# EAGLE design GB202-CC-Modem (EAGLE 7.2.0)
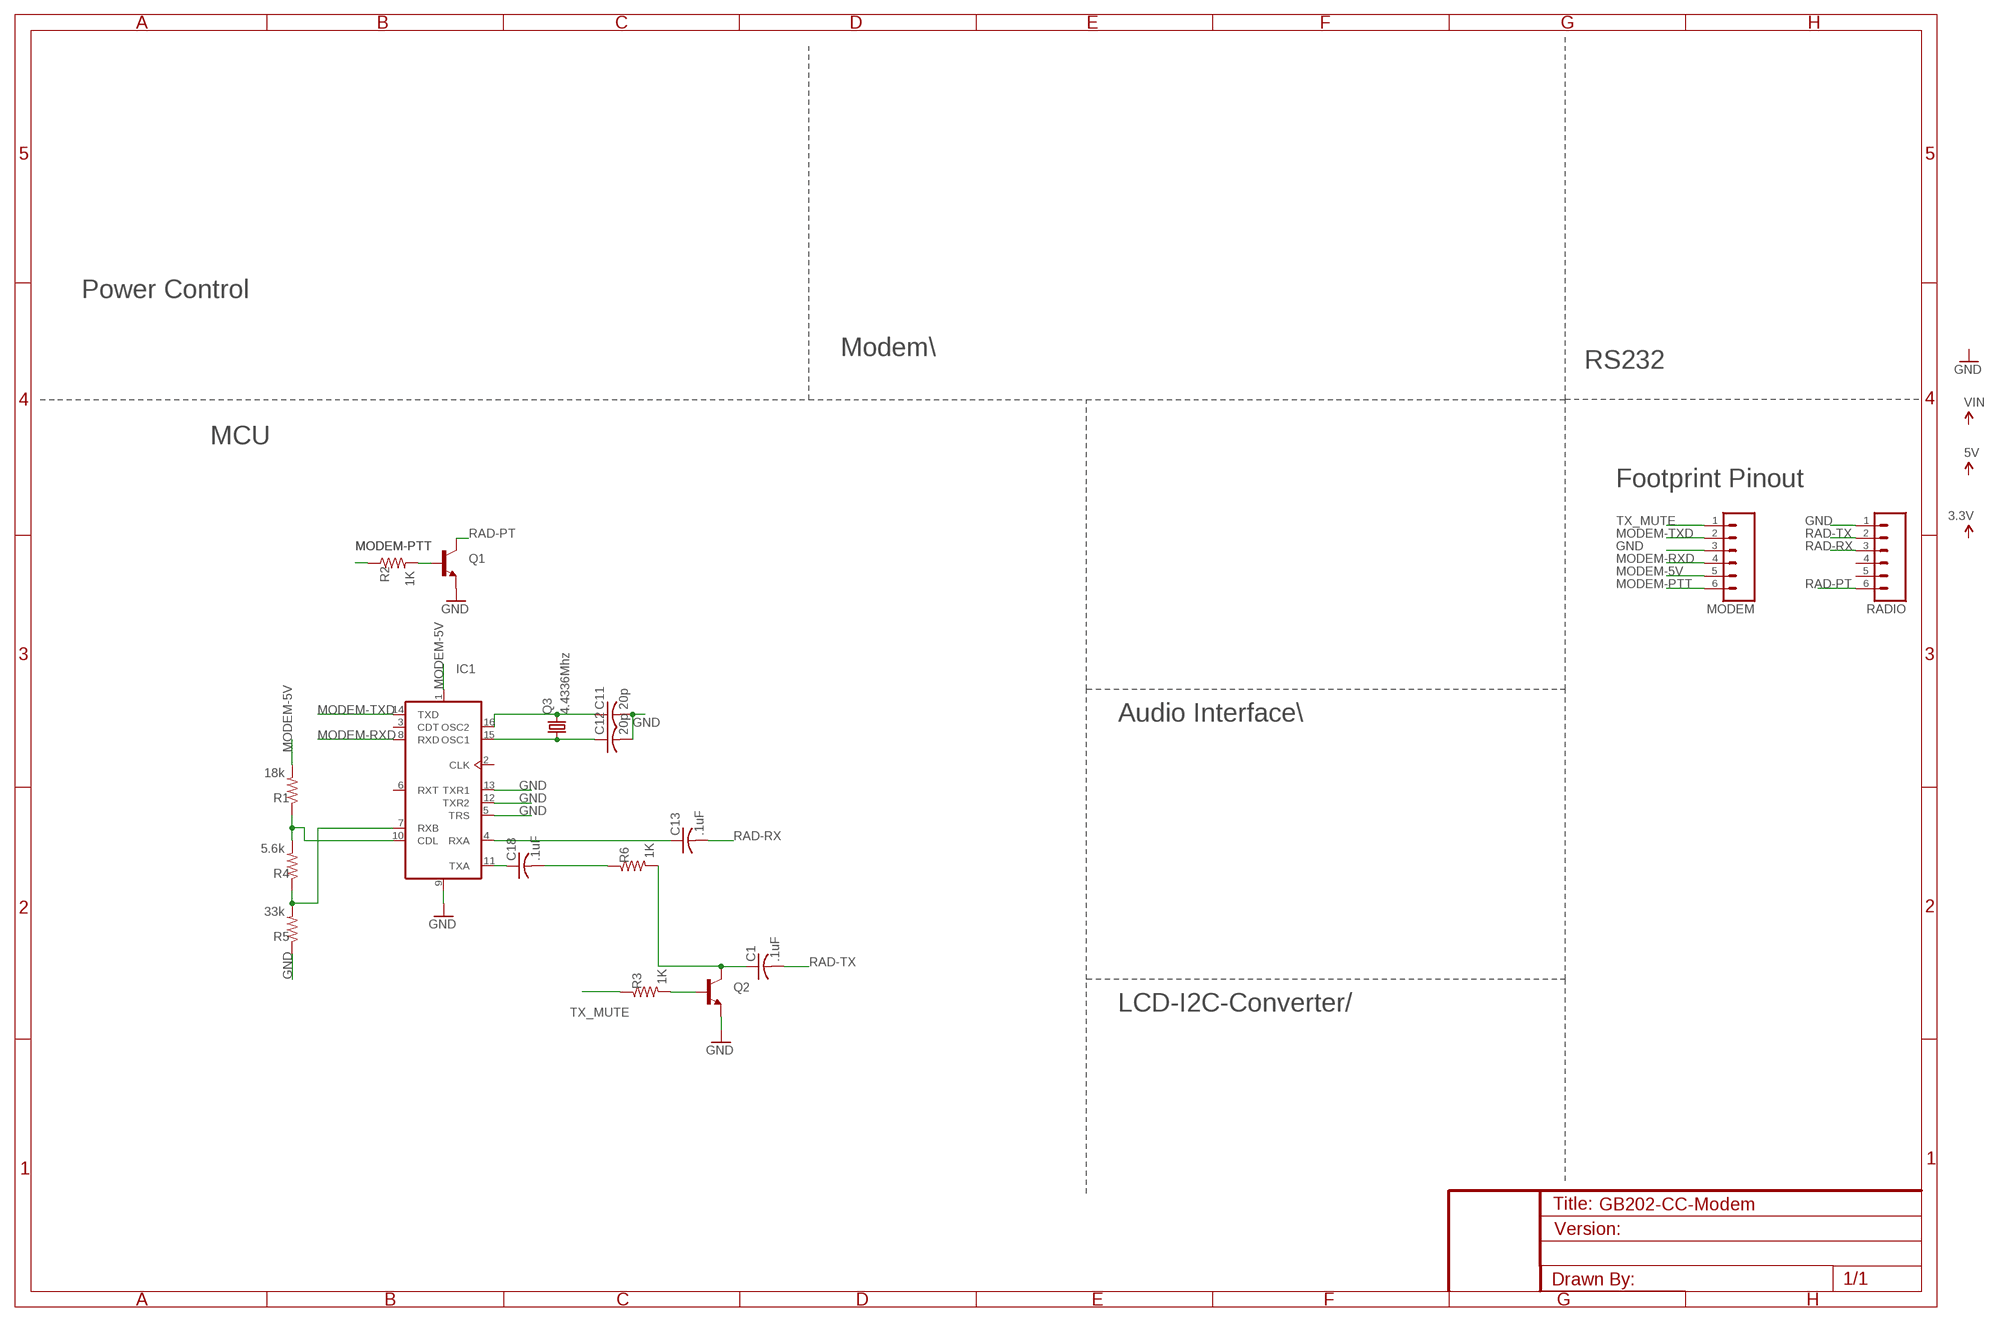
[diagram p0: schematic, sheet 1]

## Parts
C1  .1uF  C-US050-024X044  [C050-024X044]
C11  20p  C-USC0603  [C0603]
C12  20p  C-USC0603  [C0603]
C13  .1uF  C-US050-024X044  [C050-024X044]
C18  .1uF  C-US050-024X044  [C050-024X044]
IC1  TCM3105  [DIL16]
MODEM  M06LONGPADS  [1X06_LONGPADS]
Q1  TRANSISTOR_NPNP2N2222A  [TO-92]
Q2  TRANSISTOR_NPN2N3904  [TO-92]
Q3  4.4336Mhz  CRYSTALHC49S  [HC49/S]
R1  18k  RESISTORAXIAL-0.3  [AXIAL-0.3]
R2  1K  RESISTORAXIAL-0.3  [AXIAL-0.3]
R3  1K  RESISTORAXIAL-0.3  [AXIAL-0.3]
R4  5.6k  RESISTORAXIAL-0.3  [AXIAL-0.3]
R5  33k  RESISTORKIT  [AXIAL-0.3-KIT]
R6  1K  RESISTORAXIAL-0.3  [AXIAL-0.3]
RADIO  M06LONGPADS  [1X06_LONGPADS]

## Nets
GND: C11.2 C12.2 IC1.5(TRS) IC1.9(VSS) IC1.12(TXR2) IC1.13(TXR1) MODEM.3 Q1.3(E) Q2.1(E) R5.P$1 RADIO.1
MODEM-5V: IC1.1(VDD) MODEM.5 R1.P$2
MODEM-PTT: MODEM.6 R2.P$1
MODEM-RXD: IC1.8(RXD) MODEM.4
MODEM-TXD: IC1.14(TXD) MODEM.2
N$1: Q1.2(B) R2.P$2
N$2: C1.1 Q2.3(C) R6.P$2
N$6: Q2.2(B) R3.P$2
N$10: C11.1 IC1.16(OSC2) Q3.2
N$11: C12.1 IC1.15(OSC1) Q3.1
N$12: C13.1 IC1.4(RXA)
N$17: IC1.10(CDL) R1.P$1 R4.P$2
N$18: IC1.7(RXB) R4.P$1 R5.P$2
N$19: C18.1 IC1.11(TXA)
N$20: C18.2 R6.P$1
RAD-PT: Q1.1(C) RADIO.6
RAD-RX: C13.2 RADIO.3
RAD-TX: C1.2 RADIO.2
TX_MUTE: MODEM.1 R3.P$1
Unconnected: IC1.2(CLK) IC1.3(CDT) IC1.6(RXT) RADIO.4 RADIO.5

## Notes on the sheet
- Power Control
- Modem\
- RS232
- MCU
- Footprint Pinout
- Audio Interface\
- LCD-I2C-Converter/

## Library data of the parts
C1 C11-C13 C18 = rcl:C-US: CAPACITOR, American symbol
IC1 = tcm3105:TCM3105
MODEM RADIO = SparkFun-Connectors:M06: Header 6 Standard 6-pin 0.1" header. Use with straight break away headers (SKU : PRT-00116), right angle break away headers (PRT-00553), swiss pins (PRT-00743), machine pins (PRT-00117), and female headers (PRT-00115). Molex polarized connector foot print use with SKU : PRT-08094 with associated crimp pins and housings. NOTES ON THE VARIANTS LOCK and LOCK_LONGPADS... This footprint was designed to help hold the alignment of a through-hole component (i.e. 6-pin header) while soldering it into place. You may notice that each hole has been shifted either up or down by 0.005 of an inch from it's more standard position (which is a perfectly straight line). This slight alteration caused the pins (the squares in the middle) to touch the edges of the holes. Because they are alternating, it causes a "brace" to hold the component in place. 0.005 has proven to be the perfect amount of "off-center" position when using our standard breakaway headers. Although looks a little odd when you look at the bare footprint, once you have a header in there, the alteration is very hard to notice. Also,if you push a header all the way into place, it is covered up entirely on the bottom side. This idea of altering the position of holes to aid alignment will be further integrated into the Sparkfun Library for other footprints. It can help hold any component with 3 or more connection pins.
Q1 = SparkFun-DiscreteSemi:TRANSISTOR_NPN: Generic NPN BJT MMBT2222A - TRANS-08049 (SOT-23, 1A 40V) MPSA42 - TRANS-09116 (SOT-23, 500mA 300V) MMBT5088LT1G - TRANS-11160 (SOT-23, 50 mA 30V) BC547 - COM-08928 <http://www.sparkfun.com/products/8928> (TO-92 45V 100mA) (1.Collector 2.Base 3.Emitter) 2N3904 - COM-00521 <http://www.sparkfun.com/products/521> (TO-92 40V 200mA) (1.Emitter 2.Base 3.Collector) P2N2222A - COM-12852 <http://www.sparkfun.com/products/12852> (TO-92 40V 600mA) (1.Collector 2.Base 3.Emitter); PROD_ID: TRANS-09536
Q2 = SparkFun-DiscreteSemi:TRANSISTOR_NPN: Generic NPN BJT MMBT2222A - TRANS-08049 (SOT-23, 1A 40V) MPSA42 - TRANS-09116 (SOT-23, 500mA 300V) MMBT5088LT1G - TRANS-11160 (SOT-23, 50 mA 30V) BC547 - COM-08928 <http://www.sparkfun.com/products/8928> (TO-92 45V 100mA) (1.Collector 2.Base 3.Emitter) 2N3904 - COM-00521 <http://www.sparkfun.com/products/521> (TO-92 40V 200mA) (1.Emitter 2.Base 3.Collector) P2N2222A - COM-12852 <http://www.sparkfun.com/products/12852> (TO-92 40V 600mA) (1.Collector 2.Base 3.Emitter); PROD_ID: TRANS-08447
Q3 = crystal:CRYSTAL: CRYSTAL; OC_FARNELL: 1667008; OC_NEWARK: unknown
R1-R6 = SparkFun-Resistors:RESISTOR: Resistor Basic schematic elements and footprints for 0603, 1206, and PTH resistors.

## Board
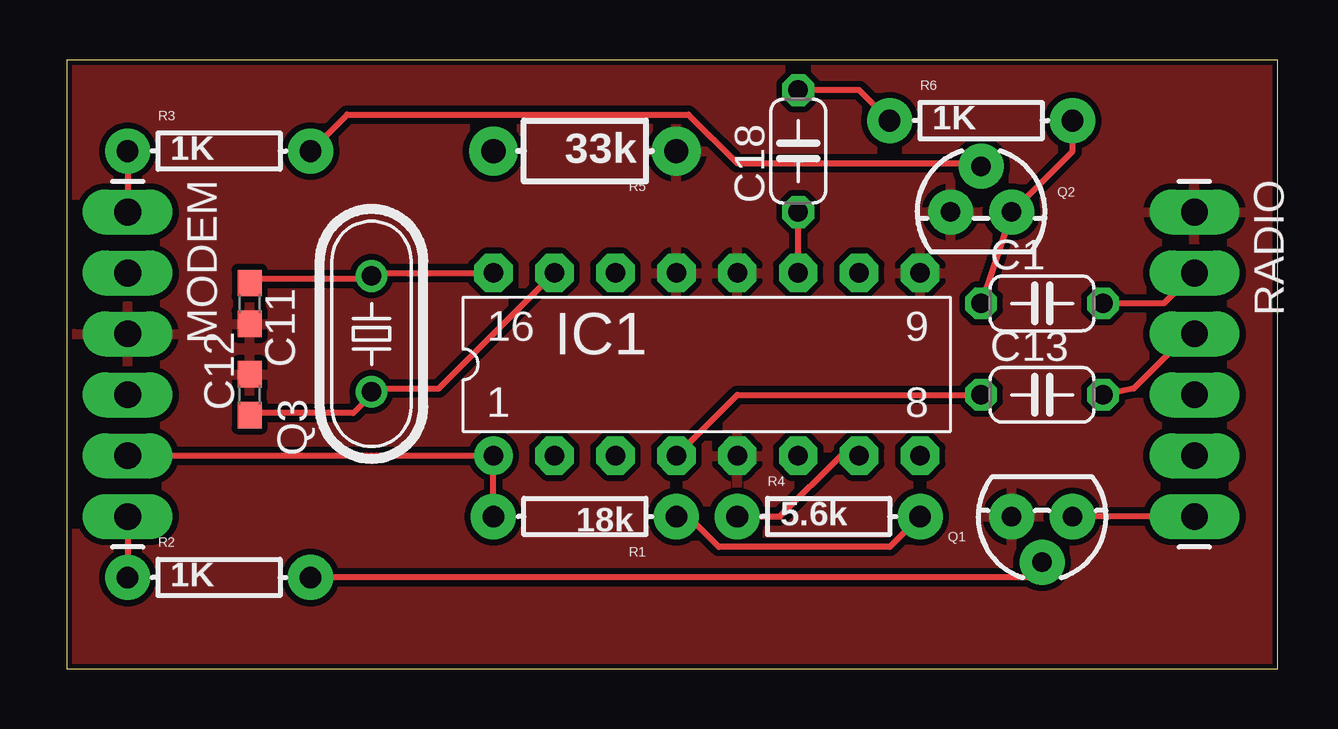
[diagram p1: board, top side]
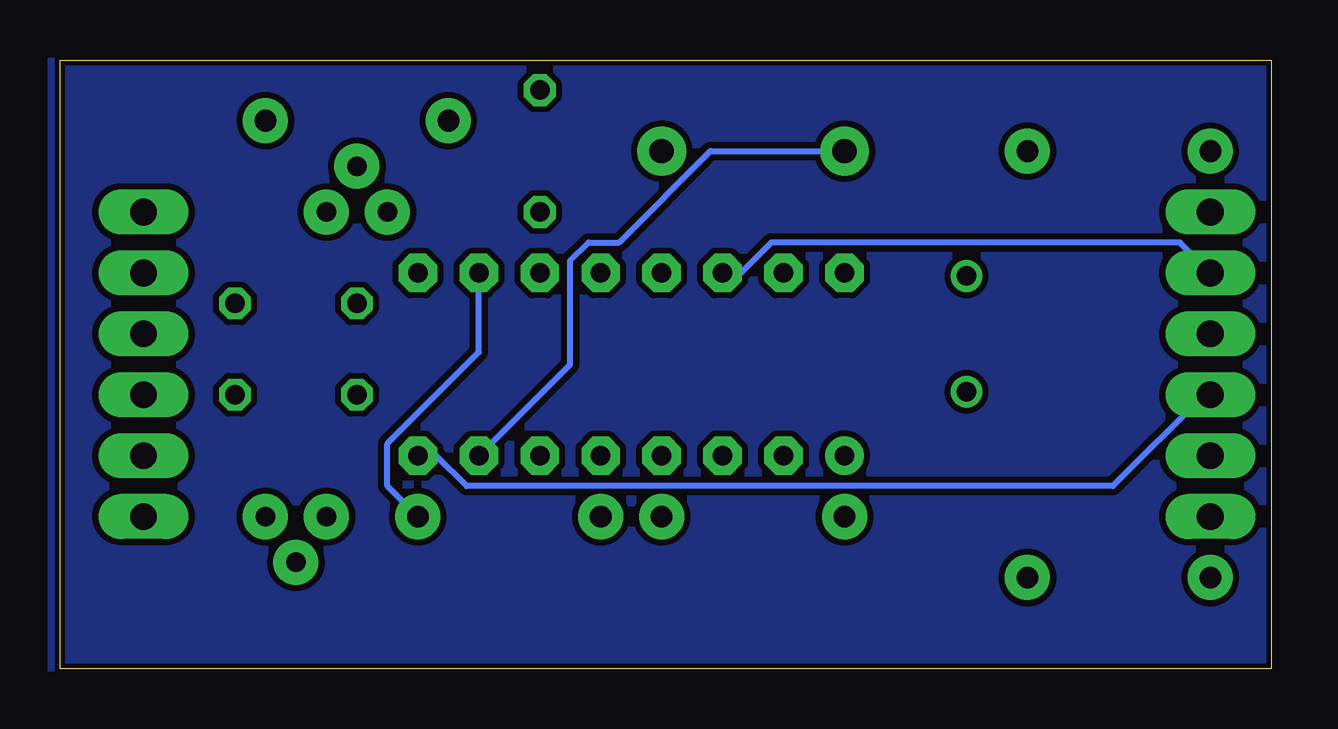
[diagram p2: board, bottom side, seen from below]

Size 50.47 x 25.39 mm. Coordinates in mm from the lower left corner, seen from the top.
Outline: 0,0 50.47,0 50.47,25.39 0,25.39 0,0
Copper layers (1*16): Top 0.035mm / dielectric 1.5mm / Bottom 0.035mm
Design rules "SparkFun-2-layer-STANDARD": minimum track width 10mil, minimum drill 20mil, track to track 10mil, track to pad 8mil, pad to pad 8mil, via to via 10mil, smd to smd 8mil, copper to edge 8mil, drill to drill 8mil, minimum pad ring 10mil, minimum via ring 10mil, stop-mask expansion 4mil, vias tented up to drill 20mil, thermal gap 10mil

### Footprints (pad centres in the part's own frame; a part is rotated, then mirrored left to right if it is on the bottom)
C050-024X044 = drill 0.813 octagon: 1 -2.54,0; 2 2.54,0
C0603 = smd 1.1 x 1: 1 -0.85,0; 2 0.85,0
DIL16 = drill 0.813 pad 1.6: 1 -8.89,-3.81 | drill 0.813 pad 1.6 octagon: 2 -6.35,-3.81; 3 -3.81,-3.81; 4 -1.27,-3.81; 5 1.27,-3.81; 6 3.81,-3.81; 7 6.35,-3.81; 8 8.89,-3.81; 9 8.89,3.81; 10 6.35,3.81; 11 3.81,3.81; 12 1.27,3.81; 13 -1.27,3.81; 14 -3.81,3.81; 15 -6.35,3.81; 16 -8.89,3.81
1X06_LONGPADS = drill 1.118 pad 1.88 long: 1 0,0; 2 2.54,0; 3 5.08,0; 4 7.62,0; 5 10.16,0; 6 12.7,0
TO-92 = drill 0.813 pad 1.88: 1 -1.27,0; 2 0,1.905; 3 1.27,0
HC49/S = drill 0.813: 1 -2.413,0; 2 2.413,0
AXIAL-0.3 = drill 0.9 pad 1.88: P$1 -3.81,0; P$2 3.81,0
AXIAL-0.3-KIT = drill 1.016 pad 2.032: P$1 -3.81,0; P$2 3.81,0

### Placement (x,y rotation side)
C1  40.64,15.24 0 top
C11  7.62,15.24 270 top
C12  7.62,11.43 90 top
C13  40.64,11.43 0 top
C18  30.48,21.59 90 top
IC1  26.67,12.7 0 top
MODEM  2.54,19.05 270 top
Q1  40.64,6.35 180 top
Q2  38.1,19.05 0 top
Q3  12.7,13.97 90 top
R1  21.59,6.35 180 top
R2  6.35,3.81 0 top
R3  6.35,21.59 0 top
R4  31.75,6.35 0 top
R5  21.59,21.59 180 top
R6  38.1,22.86 0 top
RADIO  46.99,19.05 270 top

### Tracks (layer width: path | path; a pad name or v marks a point on that pad's centre or on a via)
GND
  pour Top: 0,25.4 50.8,25.4 50.8,22.86 50.8,0 0,0
MODEM-5V
  Top 0.254: R1.P$2 IC1.1 MODEM.5
MODEM-PTT
  Top 0.254: MODEM.6 R2.P$1
MODEM-RXD
  Bottom 0.254: IC1.8 34.8,8.89 33.53,7.62 6.6,7.62 2.79,11.43 MODEM.4
MODEM-TXD
  Bottom 0.254: IC1.14 22.1,16.51 20.83,17.78 3.81,17.78 MODEM.2
N$1
  Top 0.254: R2.P$2 40.13,3.81 40.64,4.32 Q1.2
N$2
  Top 0.254: C1.1 Q2.3 41.91,21.59 R6.P$2
N$3
  pour Bottom: 0,25.4 50.8,25.4 50.8,20.32 50.8,0 0,0
N$6
  Top 0.254: R3.P$2 11.68,23.11 25.91,23.11 27.94,21.08 38.1,21.08 Q2.2
N$10
  Top 0.254: C11.1 7.62,16.26 12.7,16.26 Q3.2 12.7,16.51 IC1.16
N$11
  Top 0.254: C12.1 7.62,10.67 11.94,10.67 12.7,11.43 Q3.1 12.7,11.68 15.49,11.68 IC1.15
N$12
  Top 0.254: C13.1 27.94,11.43 IC1.4
N$17
  Top 0.254: R1.P$1 25.91,6.35 27.18,5.08 34.29,5.08 R4.P$2
  Bottom 0.254: IC1.10 33.02,13.21 36.83,9.4 36.83,7.62 R4.P$2
N$18
  Top 0.254: IC1.7 32.26,8.89 29.72,6.35 R4.P$1
  Bottom 0.254: R5.P$2 23.37,21.59 27.18,17.78 28.45,17.78 29.21,17.02 29.21,12.7 IC1.7
N$19
  Top 0.254: IC1.11 C18.1
N$20
  Top 0.254: C18.2 33.02,24.13 R6.P$1
RAD-PT
  Top 0.254: RADIO.6 Q1.1
RAD-RX
  Top 0.254: C13.2 44.45,11.68 46.74,13.97 RADIO.3
RAD-TX
  Top 0.254: C1.2 45.72,15.24 RADIO.2
TX_MUTE
  Top 0.254: R3.P$1 MODEM.1